# Altium schematic sheet Bipolar_Offset_Shifter.SchDoc
size A4; CompanyName: WEITI ISE; Address1: ul. Nowowiejska 15/19; Address2: 00-665 Warszawa; DocumentNumber: 5; SheetNumber: 5; SheetTotal: 11
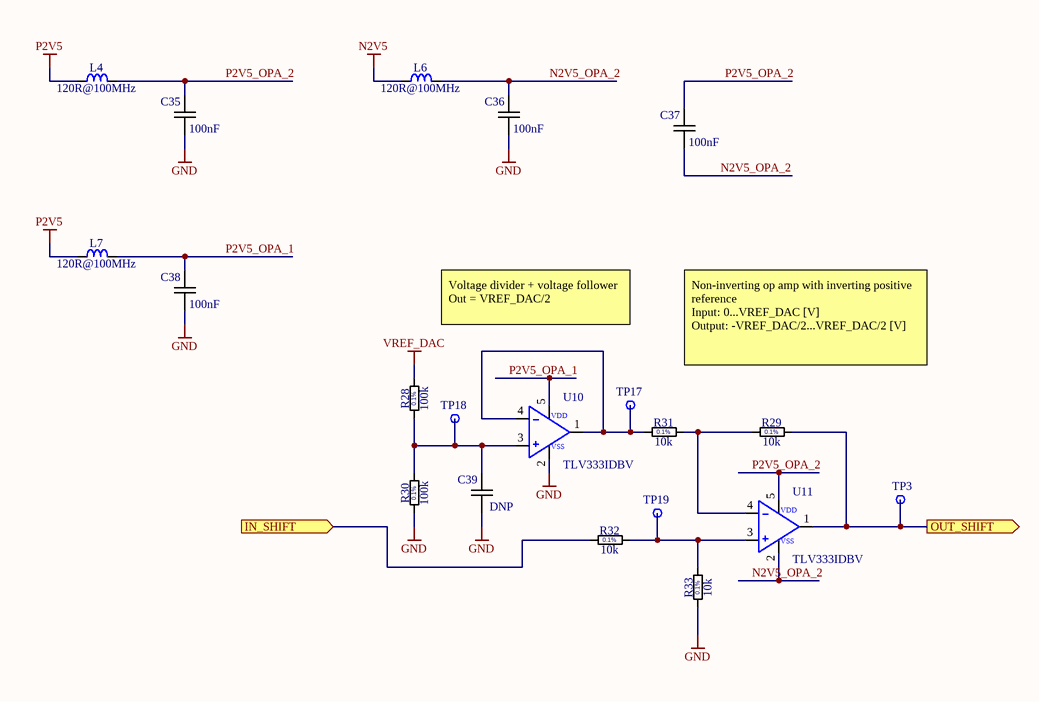
[diagram p0: Bipolar_Offset_Shifter.SchDoc]

## Parts
C35  100nF  [CAPC0603X90N]
C36  100nF  [CAPC0603X90N]
C37  100nF  [CAPC0603X90N]
C38  100nF  [CAPC0603X90N]
C39  DNP  [CAPC0603X90N]
L4  120R@100MHz  [INDC0603X90N]
L6  120R@100MHz  [INDC0603X90N]
L7  120R@100MHz  [INDC0603X90N]
R28  100k  [RESC0603X60N]
R29  10k  [RESC0603X60N]
R30  100k  [RESC0603X60N]
R31  10k  [RESC0603X60N]
R32  10k  [RESC0603X60N]
R33  10k  [RESC0603X60N]
TP3  TestPoint  [TESTPOINT_SMD_C1P27MM]  (value not drawn)  (no BOM)
TP17  TestPoint  [TESTPOINT_SMD_C1P27MM]  (value not drawn)  (no BOM)
TP18  TestPoint  [TESTPOINT_SMD_C1P27MM]  (value not drawn)  (no BOM)
TP19  TestPoint  [TESTPOINT_SMD_C1P27MM]  (value not drawn)  (no BOM)
U10  TLV333IDBV  [SOT23-5]
U11  TLV333IDBV  [SOT23-5]

## Ports
IN_SHIFT (in), OUT_SHIFT (out)

## Nets
GND: C35.2 C36.2 C38.2 C39.2 R30.1 R33.1 U10.2(VSS)
N2V5: L6.1
P2V5: L4.1 L7.1
VREF_DAC: R28.2
IN_SHIFT: R32.1 ; port IN_SHIFT
N2V5_OPA_2: C36.1 C37.2 L6.2 U11.2(VSS)
OUT_SHIFT: R29.2 TP3.1 U11.1 ; port OUT_SHIFT
P2V5_OPA_1: C38.1 L7.2 U10.5(VDD)
P2V5_OPA_2: C35.1 C37.1 L4.2 U11.5(VDD)
NetC39_1: C39.1 R28.1 R30.2 TP18.1 U10.3
NetR29_1: R29.1 R31.2 U11.4
NetR31_1: R31.1 TP17.1 U10.1 U10.4
NetR32_2: R32.2 R33.2 TP19.1 U11.3

## Notes on the sheet
- Voltage divider + voltage follower
  Out = VREF_DAC/2
- Non-inverting op amp with inverting positive reference
  Input: 0...VREF_DAC [V]
  Output: -VREF_DAC/2...VREF_DAC/2 [V]
- Project:
- Title
- File:
- Drawn by:
- Engineer:
- Checked by:
- Szymon Jedliński
- Sheet:
- Revision:
- Total Sheet:
- 1.0
- Variant:
- Approved by:
- Date:
- (in symbol R0603_10k_0.1W_25PPM) 0.1%
- (in symbol R0603_100k_0.1W_25PPM) 0.1%

## Library data of the parts
C35-C38 = CC0603_100NF_16V_10%_X7R: Non-polarised capacitor; Manufacturer Part Number: VJ0603Y104KXJCW1BC; DesignItemId: CC0603_100NF_16V_10%_X7R; HelpURL: https://www.vishay.com/docs/28548/vjw1bcbascomseries.pdf; Height: 0.8mm; SMD: Yes; Value: 100nF
C39 = CC0603_DNP: Non-polarised capacitor; Manufacturer Part Number: UNDEFINED; DesignItemId: CC0603_DNP; Height: 0.8mm; SMD: Yes; Value: DNP
L4 L6 L7 = FB0603_120R@100MHZ_2A: Ferrite Bead; Manufacturer Part Number: BLM18PG121SN1D; Manufacturer 1 Component Height: 0.8mm; Tolerance: 25%; DesignItemId: FB0603_120R@100MHZ_2A; HelpURL: https://www.tme.eu/Document/19a35c43258593752611d1c31a7dbf1a/MURATA-BLM18P.pdf; SMD: Yes; Value: 120R@100MHz
R28 R30 = R0603_100k_0.1W_25PPM: General Purpose Thick Film Chip Resistor; Manufacturer Part Number: RT0603BRD07100KL; Manufacturer 1 Component Height: 0.45mm; Tolerance: 0.10%; Voltage: 75V; DesignItemId: R0603_100k_0.1W_25PPM; HelpURL: https://www.mouser.pl/datasheet/2/447/PYu_RT_1_to_0_01_RoHS_L_12-3003070.pdf; SMD: Yes; Value: 100k
R29 R31-R33 = R0603_10k_0.1W_25PPM: General Purpose Thick Film Chip Resistor; Manufacturer Part Number: RT0603BRD0710KL; Manufacturer 1 Component Height: 0.45mm; Tolerance: 0.10%; Voltage: 75V; DesignItemId: R0603_10k_0.1W_25PPM; HelpURL: https://www.mouser.pl/datasheet/2/447/PYu_RT_1_to_0_01_RoHS_L_12-3003070.pdf; SMD: Yes; Value: 10k
TP3 TP17-TP19 = TESTPOINT_SMD_C1P27MM: 1.27mm diameter SMD Test Point Area; DesignItemId: TESTPOINT_SMD_C1P27MM; Family: TestPoint; Part Description: 1.27mm diameter SMD Test Point Area
U10 U11 = TLV333IDBV: VS = 1.8 V (±0.9 V) up to 5.5 V (±2.75 V),  350kHz, 2-?V VOS, 0.02-?V/°C, 17-?A, , Zero-Drift Series; Manufacturer 1 Component Height: 1.1mm; DesignItemId: TLV333IDBV; Device: TLV333IDBV; HelpURL: https://www.ti.com/lit/ds/symlink/tlv333.pdf?ts=1691149914735&ref_url=https%253A%252F%252Fwww.ti.com%252Fproduct%252FTLV333; Manufacturer Part Number: TLV333IDBV; SMD: Yes